# EAGLE design CarPC-CC-Rev3 (EAGLE 9.5.2)
Car-PC Command & Control sowie Power Distribution Board für PC, Access-Point

## Sheet 1 of 2
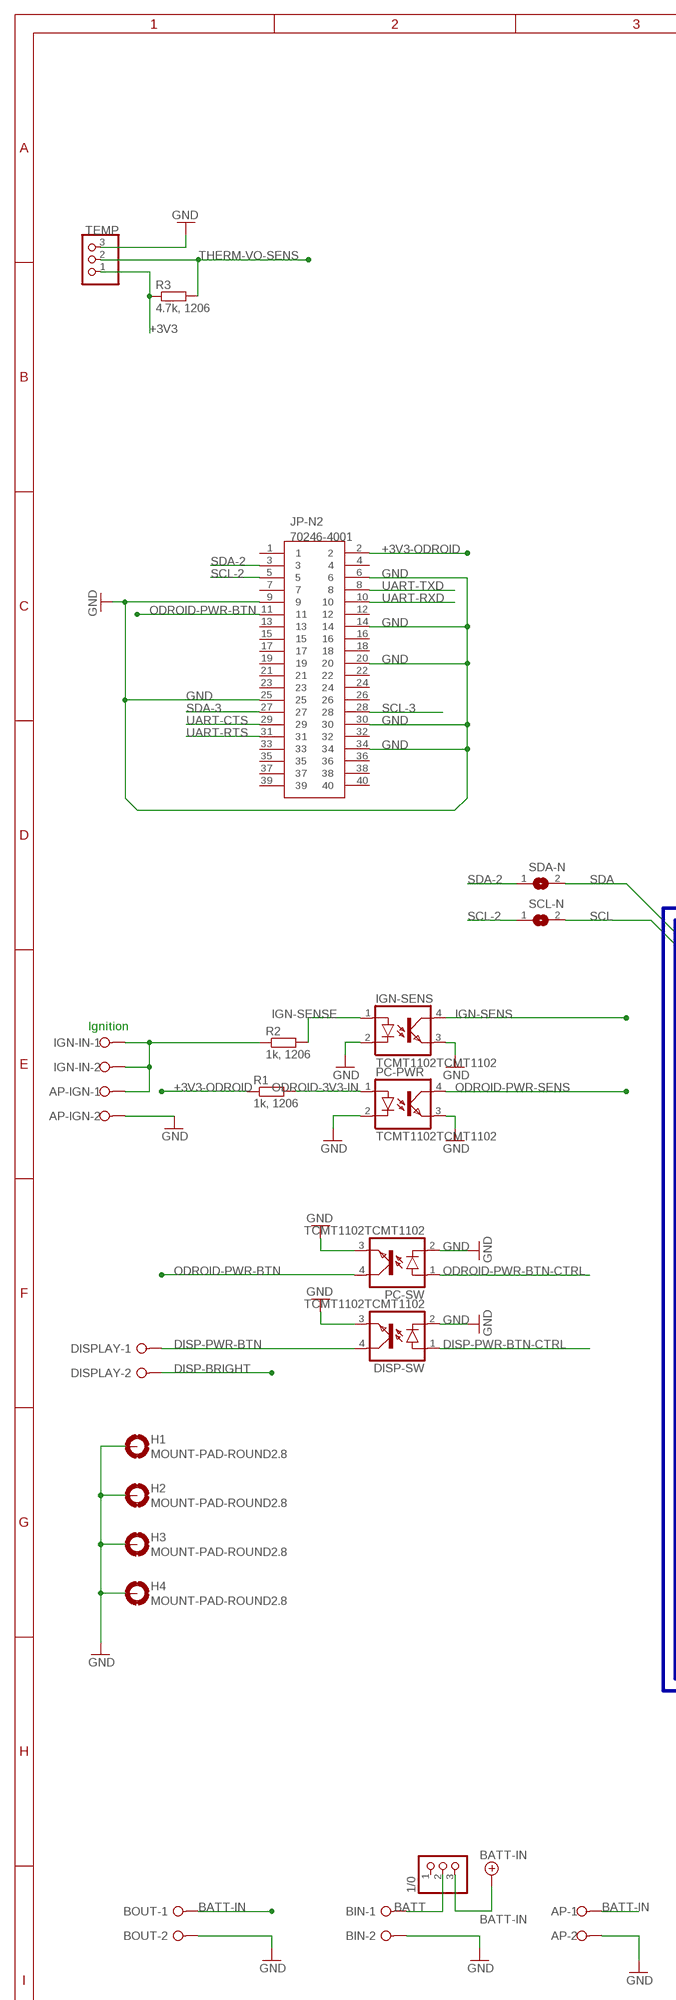
[diagram p0: schematic, sheet 1, part 1 of 2]
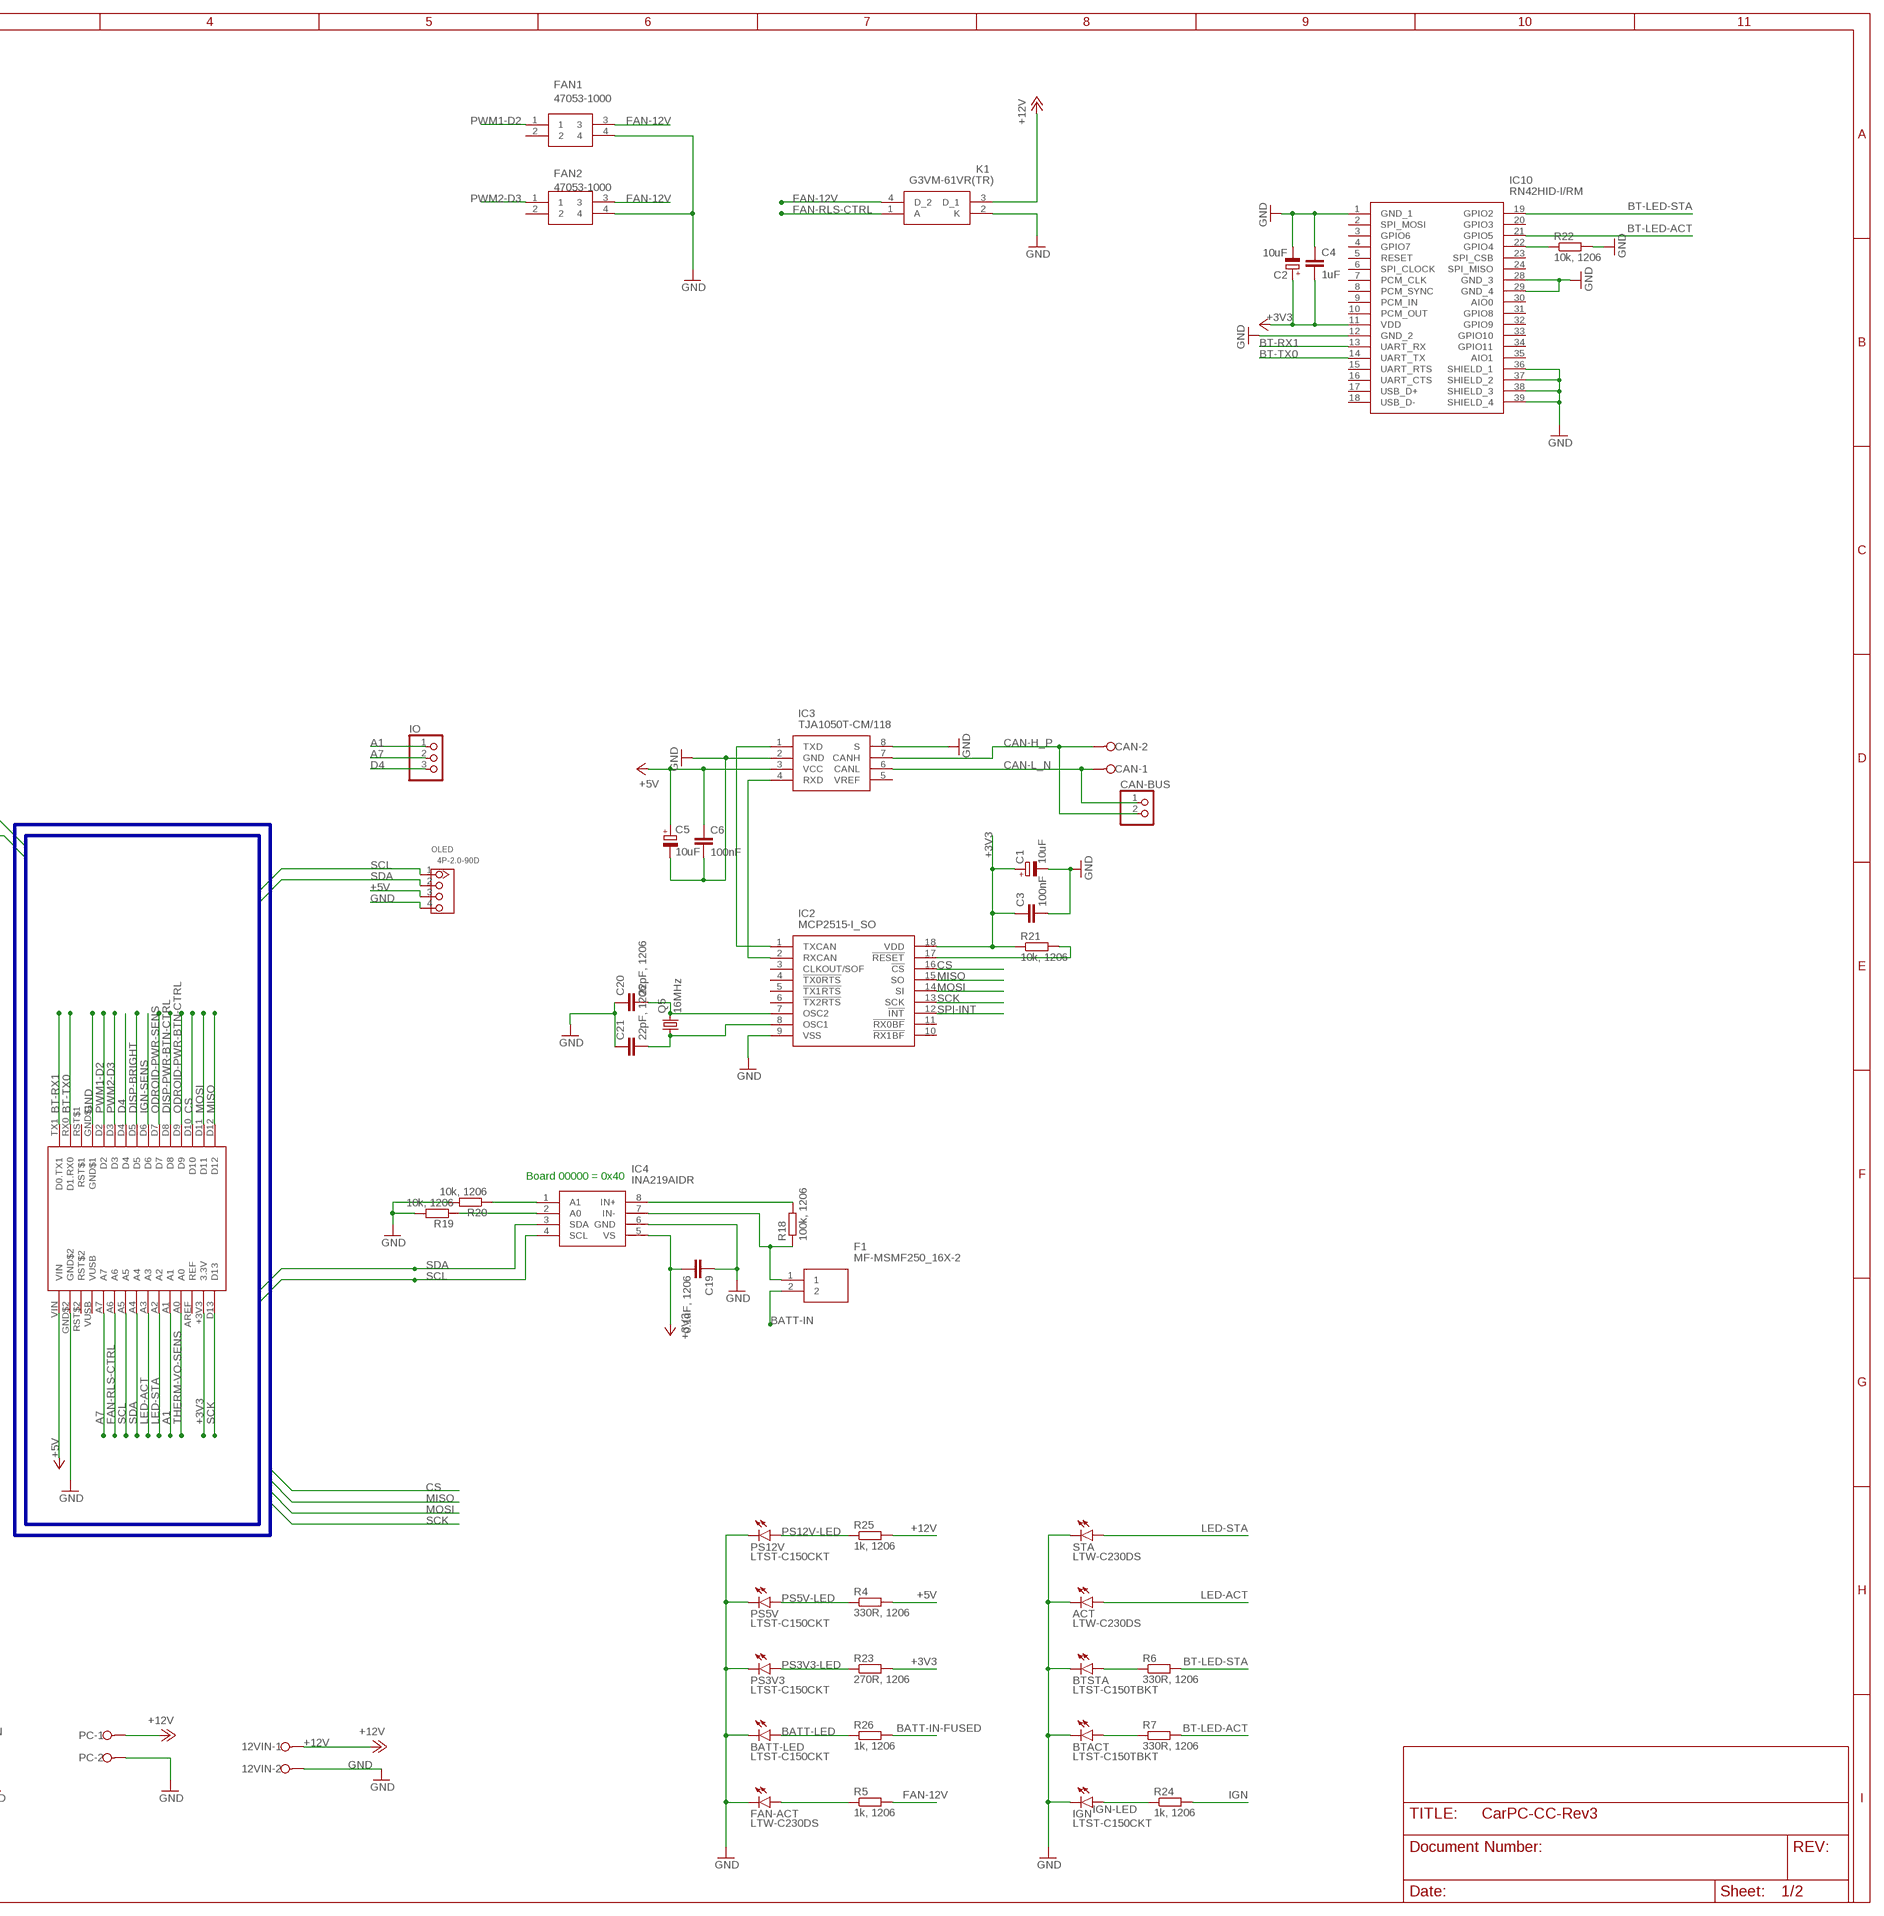
[diagram p1: schematic, sheet 1, part 2 of 2]

### Parts
1/0  PINHD-1X3  [1X03]
12VIN  W237-02P  [W237/132]
ACT  LTW-C230DS  LEDCHIPLED_1206  [CHIPLED_1206]
AP  W237-02P  [W237/132]
AP-IGN  W237-02P  [W237/132]
BATT-LED  LTST-C150CKT  LEDCHIPLED_1206  [CHIPLED_1206]
BIN  W237-02P  [W237/132]
BOUT  W237-02P  [W237/132]
BTACT  LTST-C150TBKT  LEDCHIPLED_1206  [CHIPLED_1206]
BTSTA  LTST-C150TBKT  LEDCHIPLED_1206  [CHIPLED_1206]
C1  10uF  CPOL-1206  [C1206]
C2  10uF  CPOL-1206  [C1206]
C3  100nF  C-EUC1206  [C1206]
C4  1uF  C-EUC1206  [C1206]
C5  10uF  CPOL-1206  [C1206]
C6  100nF  C-EUC1206  [C1206]
C19  0.1uF, 1206  C-EUC1206  [C1206]
C20  22pF, 1206  C-EUC1206  [C1206]
C21  22pF, 1206  C-EUC1206  [C1206]
CAN  W237-02P  [W237/132]
CAN-BUS  PINHD-1X2  [1X02]
DISP-SW  TCMT1102TCMT1102  [SOIC127P700X230-4N]
DISPLAY  W237-02P  [W237/132]
F1  MF-MSMF250_16X-2  [FUSC4632X160N]
FAN1  47053-1000  [47053-1000]
FAN2  47053-1000  [47053-1000]
FAN-ACT  LTW-C230DS  LEDCHIPLED_1206  [CHIPLED_1206]
H1  MOUNT-PAD-ROUND2.8  [2,8-PAD]
H2  MOUNT-PAD-ROUND2.8  [2,8-PAD]
H3  MOUNT-PAD-ROUND2.8  [2,8-PAD]
H4  MOUNT-PAD-ROUND2.8  [2,8-PAD]
IC2  MCP2515-I_SO  [SOIC127P1030X265-18N]
IC3  TJA1050T-CM/118  TJA1050T_CM,118  [SOIC127P600X175-8N]
IC4  INA219AIDR  [SOIC127P600X175-8N]
IC10  RN42HID-I/RM  RN42HID-I_RM  [RN42HIDIRM]
IGN  LTST-C150CKT  LEDCHIPLED_1206  [CHIPLED_1206]
IGN-IN  W237-02P  [W237/132]
IGN-SENS  TCMT1102TCMT1102  [SOIC127P700X230-4N]
IO  PINHD-1X3  [1X03]
JP-N2  70246-4001  [SHDR40W94P254_2X20_5842X889X92]
K1  G3VM-61VR(TR)  [G3VM61VRTR]
NANO_33_IOT  Arduino-Nano-33-IOT  ARDUINONANO33IOTARDUINONANO33IOT_SMD  [ARDNANO33IOT_SMD]
OLED  4P-2.0-90D  GROVE-CONNECTOR-DIP-90D(4P-2.0)  [HW4-2.0-90D]
PC  W237-02P  [W237/132]
PC-PWR  TCMT1102TCMT1102  [SOIC127P700X230-4N]
PC-SW  TCMT1102TCMT1102  [SOIC127P700X230-4N]
PS3V3  LTST-C150CKT  LEDCHIPLED_1206  [CHIPLED_1206]
PS5V  LTST-C150CKT  LEDCHIPLED_1206  [CHIPLED_1206]
PS12V  LTST-C150CKT  LEDCHIPLED_1206  [CHIPLED_1206]
Q5  16MHz  CRYSTALHC49S  [HC49-S]
R1  1k, 1206  R-EU_R1206  [R1206]
R2  1k, 1206  R-EU_R1206  [R1206]
R3  4.7k, 1206  R-EU_R1206  [R1206]
R4  330R, 1206  R-EU_R1206  [R1206]
R5  1k, 1206  R-EU_R1206  [R1206]
R6  330R, 1206  R-EU_R1206  [R1206]
R7  330R, 1206  R-EU_R1206  [R1206]
R18  100k, 1206  R-EU_R1206  [R1206]
R19  10k, 1206  R-EU_R1206  [R1206]
R20  10k, 1206  R-EU_R1206  [R1206]
R21  10k, 1206  R-EU_R1206  [R1206]
R22  10k, 1206  R-EU_R1206  [R1206]
R23  270R, 1206  R-EU_R1206  [R1206]
R24  1k, 1206  R-EU_R1206  [R1206]
R25  1k, 1206  R-EU_R1206  [R1206]
R26  1k, 1206  R-EU_R1206  [R1206]
SCL-N  SJ  [SJ]
SDA-N  SJ  [SJ]
STA  LTW-C230DS  LEDCHIPLED_1206  [CHIPLED_1206]
TEMP  PINHD-1X3/90  [1X03/90]

### Nets
+3V3 [3V3 Arduino]: C1.1(+) C2.1(+) C3.1 C4.2 C19.2 IC2.18(VDD) IC4.5(VS) IC10.11(VDD) NANO_33_IOT.+3V3(3.3V) R3.1 R21.1 R23.2 TEMP.1
+3V3-ODROID: JP-N2.2 R1.1
+5V [5v Regulated]: C5.1(+) C6.1 IC3.3(VCC) NANO_33_IOT.VIN OLED.3 R4.2 ; also sheet 2
+12V [12v Regulated]: 12VIN.1 K1.3(D_1) PC.1 R25.2 ; also sheet 2
A1: IO.1 NANO_33_IOT.A1
A7: IO.2 NANO_33_IOT.A7
BATT [11..14v Unfused]: 1/0.2 BIN.1
BATT-IN [11..14v Unfused]: 1/0.3 AP.1 BOUT.1 F1.2
BATT-IN-FUSED [11..14v Generator]: F1.1 IC4.7(IN-) R18.1 R26.2
BATT-LED: BATT-LED.A R26.1
BT-ACTIVATE [Chassis]: IC10.22(GPIO4) R22.1
BT-LED-ACT: IC10.21(GPIO5) R7.2
BT-LED-STA: IC10.19(GPIO2) R6.2
BT-RX1: IC10.13(UART_RX) NANO_33_IOT.TX1(D0.TX1)
BT-TX0: IC10.14(UART_TX) NANO_33_IOT.RX0(D1.RX0)
CAN-H_P [CAN]: CAN-BUS.2 CAN.2 IC3.7(CANH)
CAN-L_N [CAN]: CAN-BUS.1 CAN.1 IC3.6(CANL)
CS: IC2.16(!CS) NANO_33_IOT.D10
D4: IO.3 NANO_33_IOT.D4
DISP-BRIGHT [3V3 Arduino]: DISPLAY.2 NANO_33_IOT.D5
DISP-PWR-BTN: DISP-SW.4(COL) DISPLAY.1
DISP-PWR-BTN-CTRL [3V3 Arduino]: DISP-SW.1(A) NANO_33_IOT.D8
FAN-12V [12v Regulated]: FAN1.3 FAN2.3 K1.4(D_2) R5.2
FAN-RLS-CTRL [3V3 Arduino]: K1.1(A) NANO_33_IOT.A6
GND [Chassis]: 12VIN.2 ACT.C AP-IGN.2 AP.2 BATT-LED.C BIN.2 BOUT.2 BTACT.C BTSTA.C C1.2(-) C2.2(-) C3.2 C4.1 C5.2(-) C6.2 C19.1 C20.1 C21.1 DISP-SW.2(K) DISP-SW.3(EMI) FAN1.4 FAN2.4 FAN-ACT.C H1.B2,8(MOUNT) H2.B2,8(MOUNT) H3.B2,8(MOUNT) H4.B2,8(MOUNT) IC2.9(VSS) IC3.2(GND) IC3.8(S) IC4.6(GND) IC10.1(GND_1) IC10.12(GND_2) IC10.28(GND_3) IC10.29(GND_4) IC10.36(SHIELD_1) IC10.37(SHIELD_2) IC10.38(SHIELD_3) IC10.39(SHIELD_4) IGN-SENS.2(K) IGN-SENS.3(EMI) IGN.C JP-N2.6 JP-N2.9 JP-N2.14 JP-N2.20 JP-N2.25 JP-N2.30 JP-N2.34 K1.2(K) NANO_33_IOT.GND$1 NANO_33_IOT.GND$2 OLED.4 PC-PWR.2(K) PC-PWR.3(EMI) PC-SW.2(K) PC-SW.3(EMI) PC.2 PS3V3.C PS5V.C PS12V.C R19.2 R20.2 R22.2 STA.C TEMP.3 ; also sheet 2
IGN [11..14v Ignition]: AP-IGN.1 IGN-IN.1 IGN-IN.2 R2.1 R24.2
IGN-LED [12v Regulated]: IGN.A R24.1
IGN-SENS [3V3 Arduino]: IGN-SENS.4(COL) NANO_33_IOT.D6
IGN-SENSE: IGN-SENS.1(A) R2.2
INA-0X40-ADDR0: IC4.2(A0) R19.1
INA-0X40-ADDR1: IC4.1(A1) R20.1
LED-ACT: ACT.A NANO_33_IOT.A3
LED-STA: NANO_33_IOT.A2 STA.A
MCP-OSC1 [5V Signal]: C21.2 IC2.8(OSC1) Q5.1
MCP-OSC2 [5V Signal]: C20.2 IC2.7(OSC2) Q5.2
MCP-RESET: IC2.17(!RESET) R21.2
MCP-TJA-RX [5V Signal]: IC2.2(RXCAN) IC3.4(RXD)
MCP-TJA-TX [5V Signal]: IC2.1(TXCAN) IC3.1(TXD)
MISO: IC2.15(SO) NANO_33_IOT.D12
MOSI [3V3 Arduino]: IC2.14(SI) NANO_33_IOT.D11
N$2: FAN-ACT.A R5.1
N$3: BTSTA.A R6.1
N$4: BTACT.A R7.1
ODROID-3V3-IN: PC-PWR.1(A) R1.2
ODROID-PWR-BTN: JP-N2.11 PC-SW.4(COL)
ODROID-PWR-BTN-CTRL [3V3 Arduino]: NANO_33_IOT.D9 PC-SW.1(A)
ODROID-PWR-SENS [3V3 Arduino]: NANO_33_IOT.D7 PC-PWR.4(COL)
PS3V3-LED [3V3 Arduino]: PS3V3.A R23.1
PS5V-LED [5v Regulated]: PS5V.A R4.1
PS12V-LED: PS12V.A R25.1
PWM1-D2 [3V3 Signal]: FAN1.1 NANO_33_IOT.D2
PWM2-D3 [3V3 Signal]: FAN2.1 NANO_33_IOT.D3
SCK [3V3 Arduino]: IC2.13(SCK) NANO_33_IOT.D13
SCL [3V3 Signal]: IC4.4(SCL) NANO_33_IOT.A5 OLED.1 SCL-N.2
SCL-2: JP-N2.5 SCL-N.1
SCL-3: JP-N2.28
SDA [3V3 Signal]: IC4.3(SDA) NANO_33_IOT.A4 OLED.2 SDA-N.2
SDA-2: JP-N2.3 SDA-N.1
SDA-3: JP-N2.27
SHUNT+ [11..14v Generator]: IC4.8(IN+) R18.2
SPI-INT [5V Signal]: IC2.12(!INT)
THERM-VO-SENS [3V3 Arduino]: NANO_33_IOT.A0 R3.2 TEMP.2
UART-CTS: JP-N2.29
UART-RTS: JP-N2.31
UART-RXD: JP-N2.10
UART-TXD: JP-N2.8
Unconnected: 1/0.1 FAN1.2 FAN2.2 IC2.3(CLKOUT/SOF) IC2.4(!TX0RTS) IC2.5(!TX1RTS) IC2.6(!TX2RTS) IC2.10(!RX1BF) IC2.11(!RX0BF) IC3.5(VREF) IC10.2(SPI_MOSI) IC10.3(GPIO6) IC10.4(GPIO7) IC10.5(RESET) IC10.6(SPI_CLOCK) IC10.7(PCM_CLK) IC10.8(PCM_SYNC) IC10.9(PCM_IN) IC10.10(PCM_OUT) IC10.15(UART_RTS) IC10.16(UART_CTS) IC10.17(USB_D+) IC10.18(USB_D-) IC10.20(GPIO3) IC10.23(SPI_CSB) IC10.24(SPI_MISO) IC10.30(AIO0) IC10.31(GPIO8) IC10.32(GPIO9) IC10.33(GPIO10) IC10.34(GPIO11) IC10.35(AIO1) JP-N2.1 JP-N2.4 JP-N2.7 JP-N2.12 JP-N2.13 JP-N2.15 JP-N2.16 JP-N2.17 JP-N2.18 JP-N2.19 JP-N2.21 JP-N2.22 JP-N2.23 JP-N2.24 JP-N2.26 JP-N2.32 JP-N2.33 JP-N2.35 JP-N2.36 JP-N2.37 JP-N2.38 JP-N2.39 JP-N2.40 NANO_33_IOT.AREF(REF) NANO_33_IOT.RST$1 NANO_33_IOT.RST$2 NANO_33_IOT.VUSB

### Buses
I2C:SCL,SDA
SPI:CLK,CS,MISO,MOSI,SCK

### Notes on the sheet
- Ignition
- Board 00000 = 0x40

## Sheet 2 of 2: 12Vin, +3v3 and 5v out DC-DC Converters
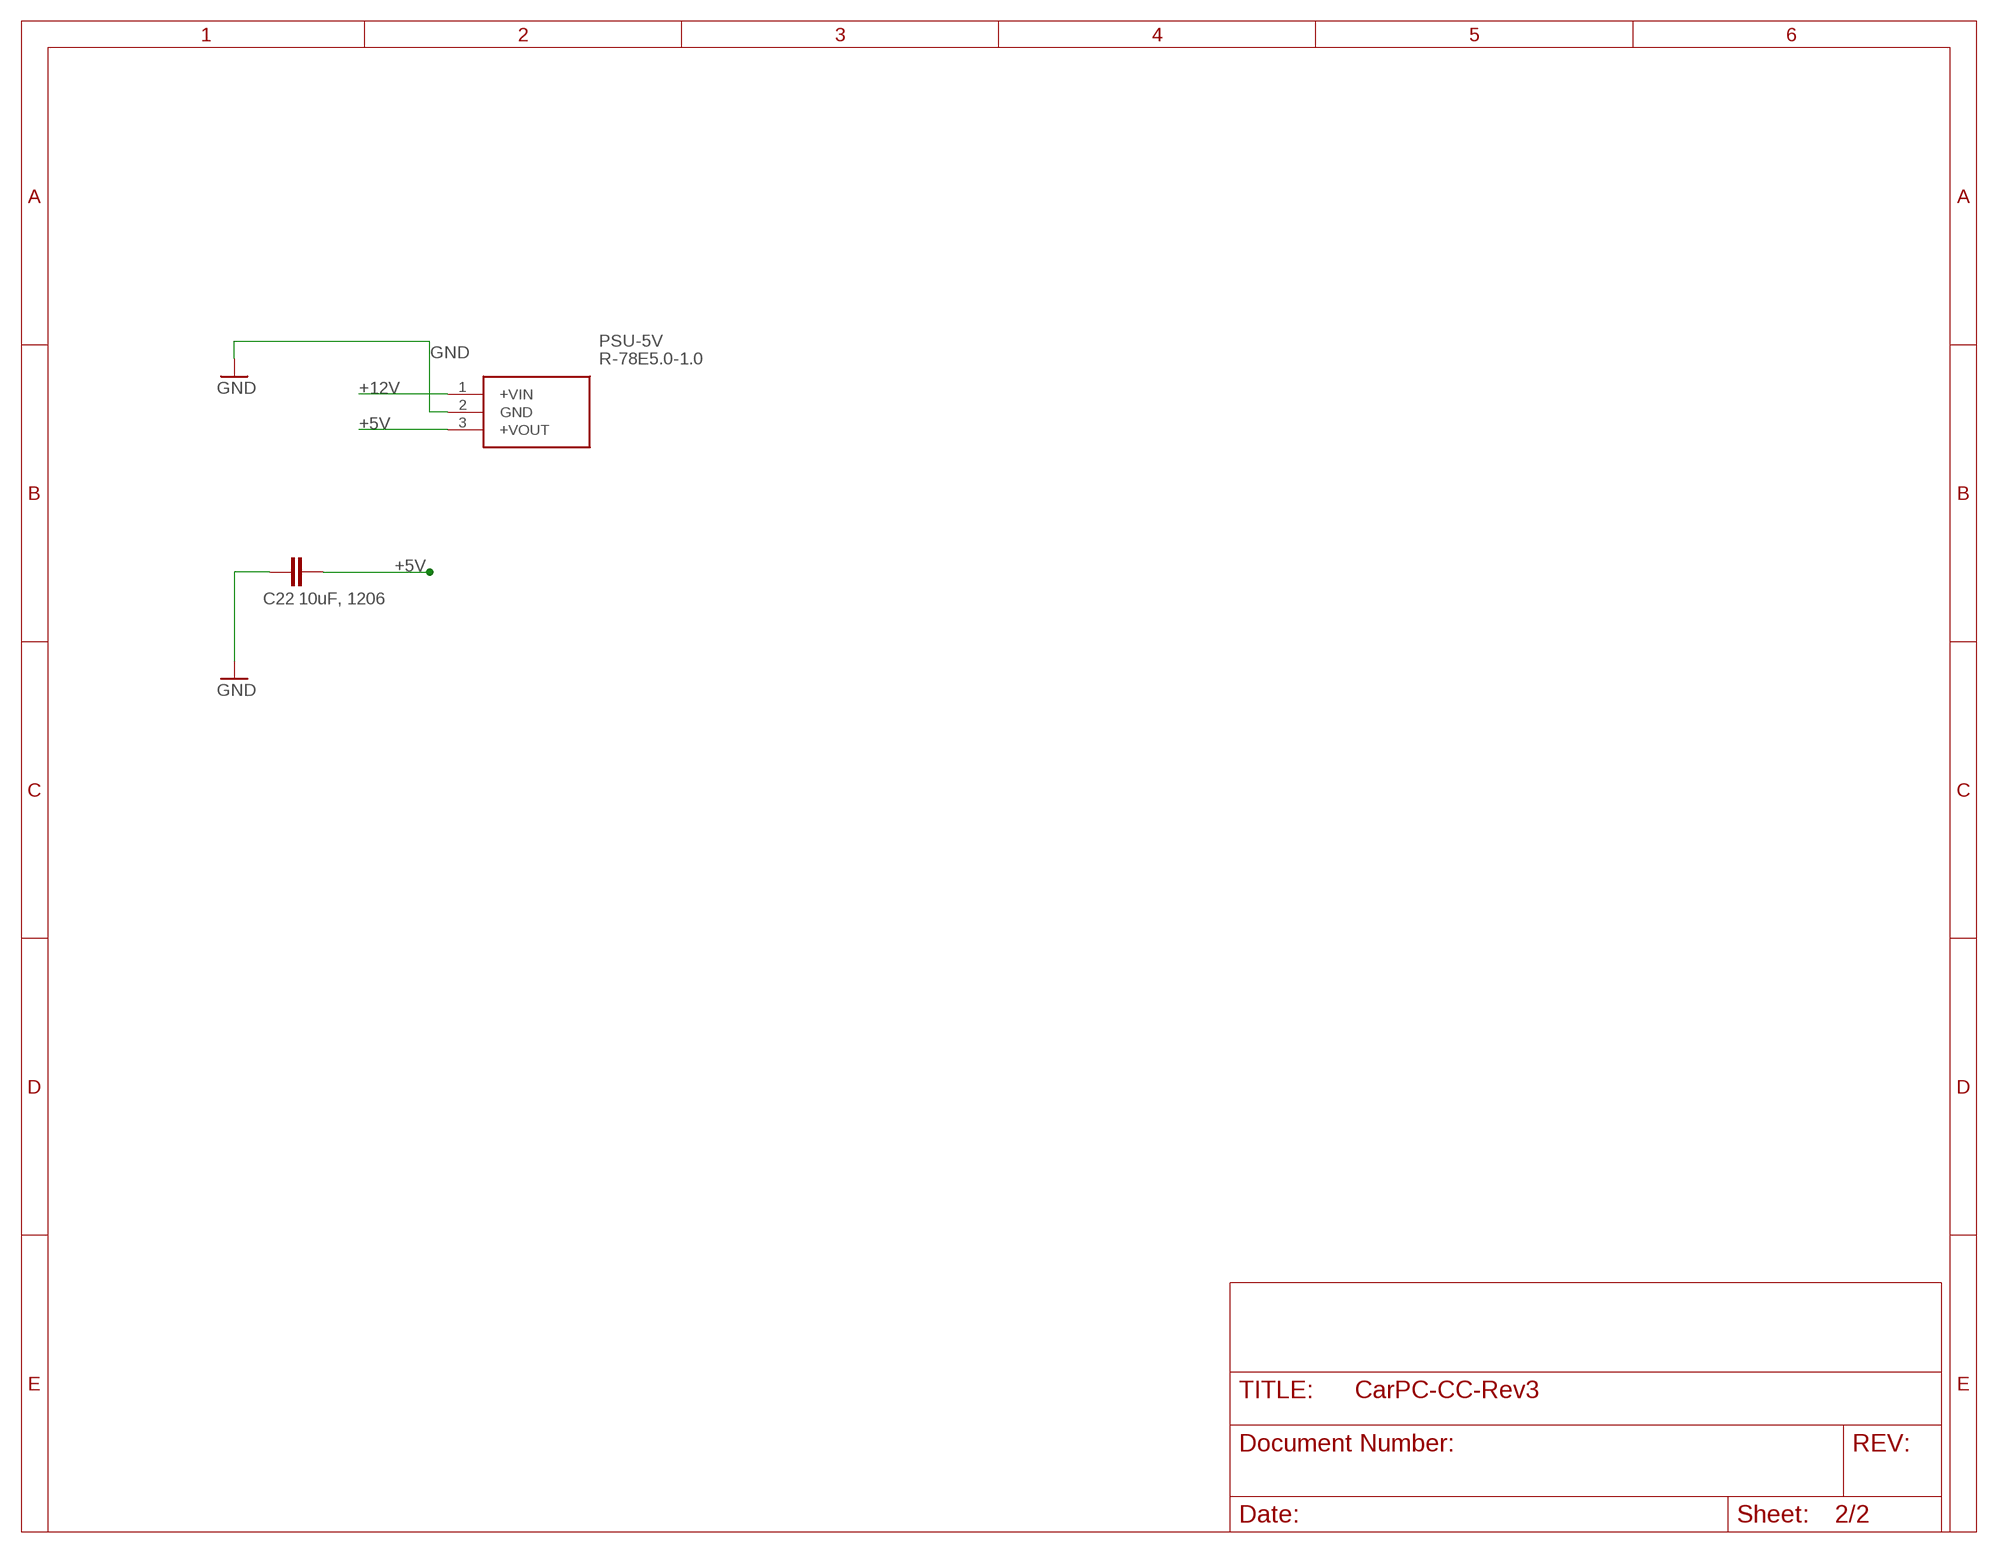
[diagram p2: schematic, sheet 2]

### Parts
C22  10uF, 1206  C-EUC1206  [C1206]
PSU-5V  R-78E5.0-1.0  [R-78E5.0-1.0]

### Nets
+5V [5v Regulated]: C22.2 PSU-5V.3(+VOUT) ; also sheet 1
+12V [12v Regulated]: PSU-5V.1(+VIN) ; also sheet 1
GND [Chassis]: C22.1 PSU-5V.2(GND) ; also sheet 1

## Library data of the parts
1/0 IO TEMP = pinhead:PINHD-1X3: PIN HEADER
12VIN AP AP-IGN BIN BOUT CAN DISPLAY IGN-IN PC = Custom:W237-02P: WAGO SREW CLAMP; OC_FARNELL: unknown; OC_NEWARK: unknown
ACT BATT-LED BTACT BTSTA FAN-ACT IGN PS3V3 PS5V PS12V STA = led:LED: LED OSRAM: - CHIPLED LG R971, LG N971, LY N971, LG Q971, LY Q971, LO R971, LY R971 LH N974, LH R974 LS Q976, LO Q976, LY Q976 LO Q996 - Hyper CHIPLED LW Q18S LB Q993, LB Q99A, LB R99A - SideLED LS A670, LO A670, LY A670, LG A670, LP A670 LB A673, LV A673, LT A673, LW A673 LH A674 LY A675 LS A676, LA A676, LO A676, LY A676, LW A676 LS A679, LY A679, LG A679 - Hyper Micro SIDELED® LS Y876, LA Y876, LO Y876, LY Y876 LT Y87S - SmartLED LW L88C, LW L88S LB L89C, LB L89S, LG L890 LS L89K, LO L89K, LY L89K LS L896, LA L896, LO L896, LY L896 - TOPLED LS T670, LO T670, LY T670, LG T670, LP T670 LSG T670, LSP T670, LSY T670, LOP T670, LYG T670 LG T671, LOG T671, LSG T671 LB T673, LV T673, LT T673, LW T673 LH T674 LS T676, LA T676, LO T676, LY T676, LB T676, LH T676, LSB T676, LW T676 LB T67C, LV T67C, LT T67C, LS T67K, LO T67K, LY T67K, LW E67C LS E67B, LA E67B, LO E67B, LY E67B, LB E67C, LV E67C, LT E67C LW T67C LS T679, LY T679, LG T679 LS T770, LO T770, LY T770, LG T770, LP T770 LB T773, LV T773, LT T773, LW T773 LH T774 LS E675, LA E675, LY E675, LS T675 LS T776, LA T776, LO T776, LY T776, LB T776 LHGB T686 LT T68C, LB T68C - Hyper Mini TOPLED® LB M676 - Mini TOPLED Santana® LG M470 LS M47K, LO M47K, LY M47K Source: http://www.osram.convergy.de LUXEON: - LUMILED® LXK2-PW12-R00, LXK2-PW12-S00, LXK2-PW14-U00, LXK2-PW14-V00 LXK2-PM12-R00, LXK2-PM12-S00, LXK2-PM14-U00 LXK2-PE12-Q00, LXK2-PE12-R00, LXK2-PE12-S00, LXK2-PE14-T00, LXK2-PE14-U00 LXK2-PB12-K00, LXK2-PB12-L00, LXK2-PB12-M00, LXK2-PB14-N00, LXK2-PB14-P00, LXK2-PB14-Q00 LXK2-PR12-L00, LXK2-PR12-M00, LXK2-PR14-Q00, LXK2-PR14-R00 LXK2-PD12-Q00, LXK2-PD12-R00, LXK2-PD12-S00 LXK2-PH12-R00, LXK2-PH12-S00 LXK2-PL12-P00, LXK2-PL12-Q00, LXK2-PL12-R00 Source: www.luxeon.com KINGBRIGHT: KA-3528ASYC Source: www.kingbright.com
C1 C2 C5 = Custom:CPOL-1206
C3 C4 C6 C19-C22 = rcl:C-EU: CAPACITOR, European symbol; SPICEPREFIX: C
CAN-BUS = pinhead:PINHD-1X2: PIN HEADER
DISP-SW IGN-SENS PC-PWR PC-SW = Custom:TCMT1102
F1 = Custom:MF-MSMF250_16X-2: PTC Resettable Fuse 2.5A(hold) 5A(trip) 16V 100A 1.2W 5s 0.015Ohm SMD Solder Pad 1812 T/R Automotive Source: Datasheet <https://www.arrow.com/en/products/mf-msmf25016x-2/bourns>; ALLIED_NUMBER: 70153471; ALLIED_PRICE-STOCK: https://www.alliedelec.com/bourns-mf-msmf250-16x-2/70153471/; DESCRIPTION: PTC Resettable Fuse 2.5A(hold) 5A(trip) 16V 100A 1.2W 5s 0.015Ohm SMD Solder Pad 1812 T/R Automotive; HEIGHT: 1.6mm; MANUFACTURER_NAME: Bourns; MANUFACTURER_PART_NUMBER: MF-MSMF250/16X-2; MOUSER_PART_NUMBER: 652-MF-MSMF250/16X-2; MOUSER_PRICE-STOCK: https://www.mouser.com/Search/Refine.aspx?Keyword=652-MF-MSMF250%2F16X-2; RS_PART_NUMBER: 8978967P; RS_PRICE-STOCK: http://uk.rs-online.com/web/p/products/8978967P
FAN1 FAN2 = Custom:47053-1000: MOLEX - 47053-1000 - HEADER, 4POS, 1ROW, 2.54MM Source: Datasheet <https://componentsearchengine.com/Datasheets/1/47053-1000.pdf>; DESCRIPTION: MOLEX - 47053-1000 - HEADER, 4POS, 1ROW, 2.54MM; HEIGHT: mm; MANUFACTURER_NAME: Molex; MANUFACTURER_PART_NUMBER: 47053-1000; MOUSER_PART_NUMBER: 538-47053-1000; MOUSER_PRICE-STOCK: https://www.mouser.com/Search/Refine.aspx?Keyword=538-47053-1000
H1-H4 = holes:MOUNT-PAD-ROUND: MOUNTING PAD, round
IC2 = Custom:MCP2515-I_SO: CAN Controller SPI data filtering SO18 Source: Datasheet <https://componentsearchengine.com/Datasheets/1/MCP2515-I_SO.pdf>; DESCRIPTION: CAN Controller SPI data filtering SO18; HEIGHT: 2.65mm; MANUFACTURER_NAME: Microchip; MANUFACTURER_PART_NUMBER: MCP2515-I/SO; MOUSER_PART_NUMBER: 579-MCP2515-I/SO; MOUSER_PRICE-STOCK: https://www.mouser.com/Search/Refine.aspx?Keyword=579-MCP2515-I%2FSO
IC3 = Custom:TJA1050T_CM,118: NXP - TJA1050T/CM,118 - CAN TRANSCEIVER, 1TX/RX, SOIC-8 Source: Datasheet <https://componentsearchengine.com/Datasheets/1/TJA1050T_CM,118.pdf>; DESCRIPTION: NXP - TJA1050T/CM,118 - CAN TRANSCEIVER, 1TX/RX, SOIC-8; HEIGHT: 1.75mm; MANUFACTURER_NAME: Nexperia; MANUFACTURER_PART_NUMBER: TJA1050T/CM,118; MOUSER_PART_NUMBER: 771-TJA1050T/CM118; MOUSER_PRICE-STOCK: https://www.mouser.com/Search/Refine.aspx?Keyword=771-TJA1050T%2FCM118
IC4 = Custom:INA219AIDR: 26-V, Bidirectional, Zero-Drift, High-Side, I2C Out Current/Power Monitor Source: Datasheet <http://www.ti.com/lit/gpn/ina219>; DESCRIPTION: 26-V, Bidirectional, Zero-Drift, High-Side, I2C Out Current/Power Monitor; HEIGHT: 1.75mm; MANUFACTURER_NAME: Texas Instruments; MANUFACTURER_PART_NUMBER: INA219AIDR; MOUSER_PART_NUMBER: 595-INA219AIDR; MOUSER_PRICE-STOCK: https://www.mouser.com/Search/Refine.aspx?Keyword=595-INA219AIDR
IC10 = Custom:RN42HID-I_RM: MICROCHIP - RN42HID-I/RM - BLUETOOTH MODULE, V2.1, 3MBPS Source: Datasheet <http://ww1.microchip.com/downloads/en/DeviceDoc/50002328A.pdf>; ALLIED_NUMBER: 70451526; ALLIED_PRICE-STOCK: https://www.alliedelec.com/microchip-technology-inc-rn42hid-i-rm/70451526/; DESCRIPTION: MICROCHIP - RN42HID-I/RM - BLUETOOTH MODULE, V2.1, 3MBPS; HEIGHT: 2mm; MANUFACTURER_NAME: Microchip; MANUFACTURER_PART_NUMBER: RN42HID-I/RM; MOUSER_PART_NUMBER: 765-RN42HID-I/RM; MOUSER_PRICE-STOCK: https://www.mouser.com/Search/Refine.aspx?Keyword=765-RN42HID-I%2FRM; RS_PART_NUMBER: 9123020; RS_PRICE-STOCK: http://uk.rs-online.com/web/p/products/9123020
JP-N2 = Custom:70246-4001: Header 2.54mm, dual row, vertical, 40w Molex C-GRID Series, Series Number 70246, 2.54mm Pitch 40 Way 2 Row Straight PCB Header, Solder Termination, 2.5A Source: Datasheet <http://uk.rs-online.com/web/p/products/6701825>; ALLIED_NUMBER: 70373451; ALLIED_PRICE-STOCK: https://www.alliedelec.com/molex-incorporated-70246-4001/70373451/; DESCRIPTION: Header 2.54mm, dual row, vertical, 40w Molex C-GRID Series, Series Number 70246, 2.54mm Pitch 40 Way 2 Row Straight PCB Header, Solder Termination, 2.5A; HEIGHT: 9.27mm; MANUFACTURER_NAME: Molex; MANUFACTURER_PART_NUMBER: 70246-4001; MOUSER_PART_NUMBER: 538-70246-4001; MOUSER_PRICE-STOCK: https://www.mouser.com/Search/Refine.aspx?Keyword=538-70246-4001; RS_PART_NUMBER: 6701825P; RS_PRICE-STOCK: http://uk.rs-online.com/web/p/products/6701825P
K1 = Custom:G3VM-61VR(TR): Solid State Relays - PCB Mount MOSFET Relay SOP4 60V 1400mA 1 Form A Source: Datasheet <https://www.arrow.com/en/products/g3vm-61vr-tr/omron>; ALLIED_NUMBER: 71240743; ALLIED_PRICE-STOCK: https://www.alliedelec.com/omronelectroniccomponents-g3vm-61vr-tr/71240743/; DESCRIPTION: Solid State Relays - PCB Mount MOSFET Relay SOP4 60V 1400mA 1 Form A; HEIGHT: 2.2mm; MANUFACTURER_NAME: Omron Electronics; MANUFACTURER_PART_NUMBER: G3VM-61VR(TR); MOUSER_PART_NUMBER: 653-G3VM-61VRTR; MOUSER_PRICE-STOCK: https://www.mouser.com/Search/Refine.aspx?Keyword=653-G3VM-61VRTR
NANO_33_IOT = Custom:ARDUINONANO33IOT
OLED = Custom:GROVE-CONNECTOR-DIP-90D(4P-2.0): 320110034
PSU-5V = Custom:R-78E5.0-1.0: Non-Isolated DC/DC Converters 8-28Vin 5V 1.0A THRU Source: Datasheet <http://www.recom-power.com/pdf/Innoline/R-78Exx-1.0.pdf>; DESCRIPTION: Non-Isolated DC/DC Converters 8-28Vin 5V 1.0A THRU; HEIGHT: mm; MANUFACTURER_NAME: RECOM Power; MANUFACTURER_PART_NUMBER: R-78E5.0-1.0; MOUSER_PART_NUMBER: 919-R-78E5.0-1.0; MOUSER_PRICE-STOCK: https://www.mouser.com/Search/Refine.aspx?Keyword=919-R-78E5.0-1.0; RS_PART_NUMBER: 1446290P; RS_PRICE-STOCK: http://uk.rs-online.com/web/p/products/1446290P
Q5 = Custom:CRYSTAL: CRYSTAL; OC_FARNELL: 1667008; OC_NEWARK: unknown
R1-R7 R18-R26 = rcl:R-EU_: RESISTOR, European symbol; SPICEPREFIX: R
SCL-N SDA-N = jumper:SJ: SMD solder JUMPER

## Net classes
0 default: width 0.254 mm
1 5v Regulated: width 0.762 mm
2 12v Regulated: width 1.27 mm
3 11..14v Ignition: width 1.27 mm
4 11..14v Generator: width 0.762 mm
5 Chassis: width 0.635 mm
6 0v Isolated: width 0.762 mm
7 3V3 Arduino: width 0.127 mm
8 5V Signal: width 0.127 mm
9 3V3 Signal: width 0.127 mm
10 11..14v Unfused: width 2.032 mm, clearance 0.762 mm

## Board
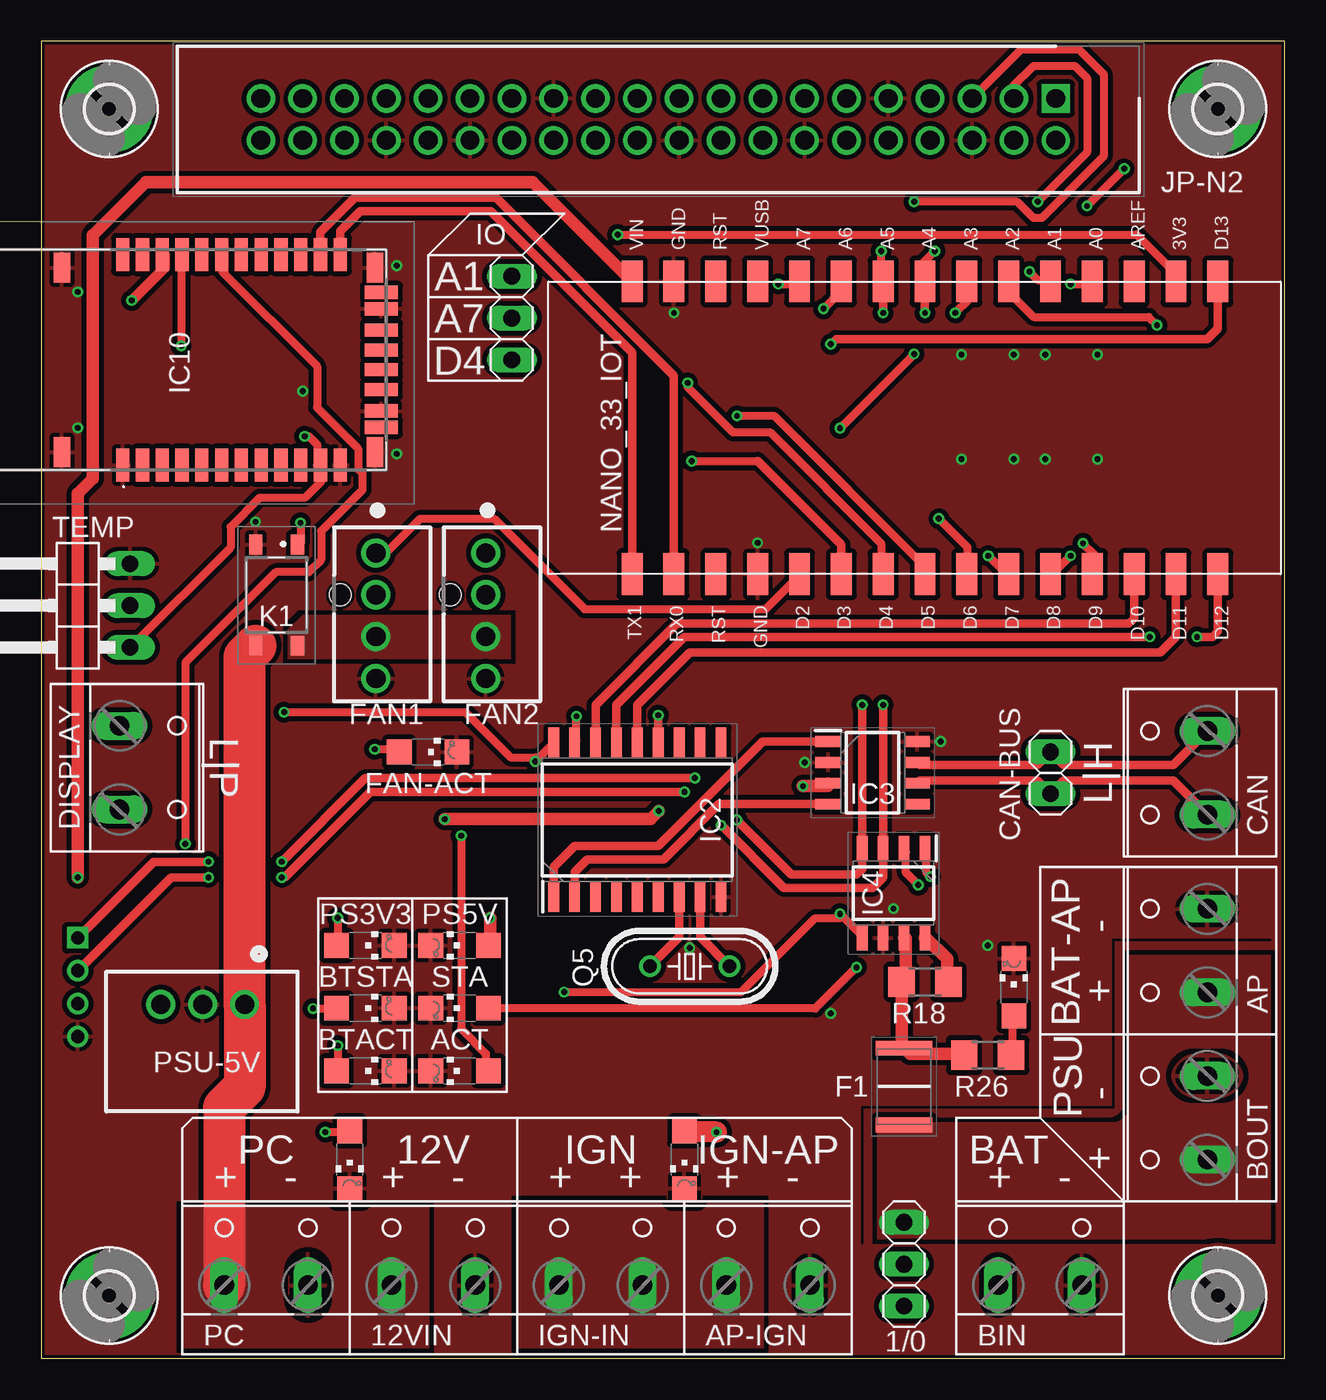
[diagram p3: board, top side]
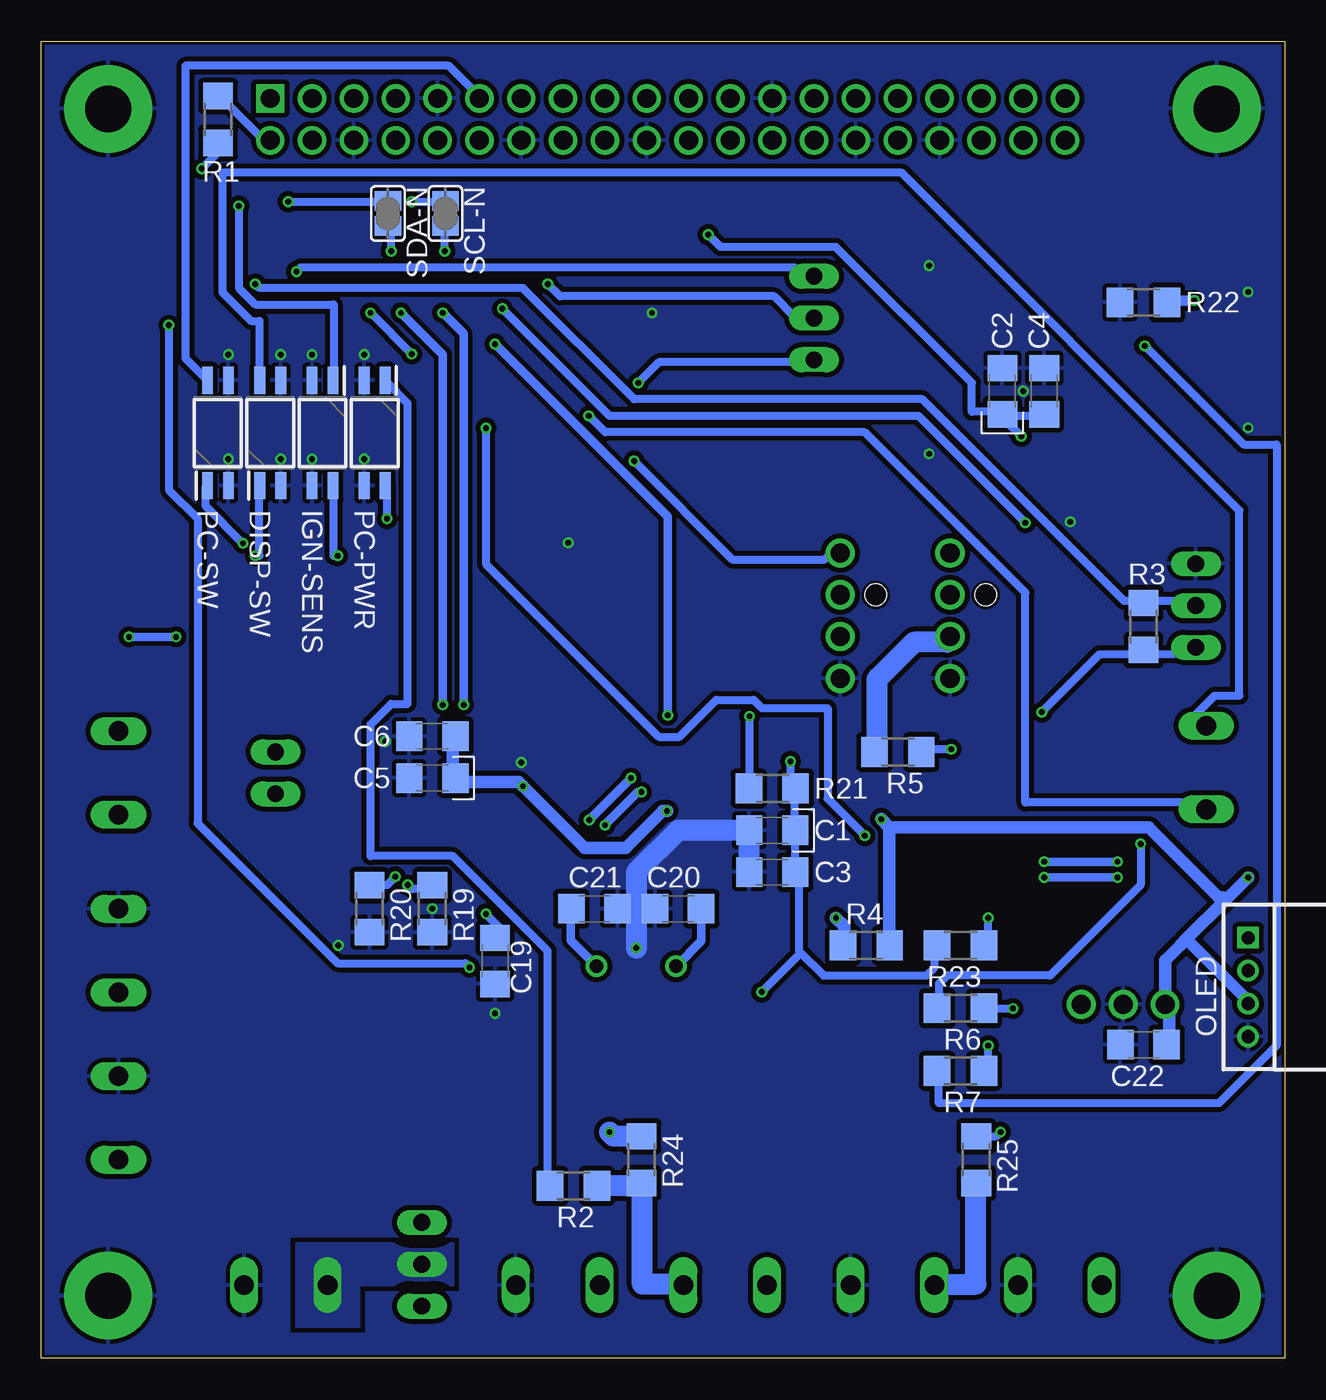
[diagram p4: board, bottom side, seen from below]

Size 75.5 x 80 mm. Coordinates in mm from the lower left corner, seen from the top.
Outline: 0,0 75.5,0 75.5,80 0,80 0,0
Copper layers (1*16): Top 0.035mm / dielectric 1.5mm / Bottom 0.035mm
Design rules "aisler_2_layer *": minimum track width 0.5mm, minimum drill 0.35mm, track to track 0.3mm, track to pad 0.2mm, pad to pad 0.2mm, via to via 0.2mm, smd to smd 0.2mm, copper to edge 0.2mm, drill to drill 0.21mm, minimum pad ring 0.25mm, minimum via ring 0.15mm, stop-mask expansion 0mil, vias tented up to drill 0.35mm, thermal gap 10mil
tRestrict: 9 lines

### Footprints (pad centres in the part's own frame; a part is rotated, then mirrored left to right if it is on the bottom)
1X03 = drill 1.016 long: 1 -2.54,0; 2 0,0; 3 2.54,0
W237/132 = drill 1.194 long: 1 -2.54,-0.635; 2 2.54,-0.635
CHIPLED_1206 = smd 1.5 x 1.5: A 0,-1.75; C 0,1.75
C1206 = smd 1.6 x 1.8: 1 -1.4,0; 2 1.4,0
1X02 = drill 1.016 long: 1 -1.27,0; 2 1.27,0
SOIC127P700X230-4N = smd 1.65 x 0.65: 1 -3.2,0.635; 2 -3.2,-0.635; 3 3.2,-0.635; 4 3.2,0.635
FUSC4632X160N = smd 0.89 x 3.43: 1 -2.325,0; 2 2.325,0
47053-1000 = drill 1.17 pad 1.77: 1 1.57,2.54; 2 4.11,2.54; 3 6.65,2.54; 4 9.19,2.54 | hole 1.3: 4.11,0.38
2,8-PAD = drill 2.8 pad 5.334: B2,8 0,0
SOIC127P1030X265-18N = smd 1.85 x 0.65: 1 -4.675,5.08; 2 -4.675,3.81; 3 -4.675,2.54; 4 -4.675,1.27; 5 -4.675,0; 6 -4.675,-1.27; 7 -4.675,-2.54; 8 -4.675,-3.81; 9 -4.675,-5.08; 10 4.675,-5.08; 11 4.675,-3.81; 12 4.675,-2.54; 13 4.675,-1.27; 14 4.675,0; 15 4.675,1.27; 16 4.675,2.54; 17 4.675,3.81; 18 4.675,5.08
SOIC127P600X175-8N = smd 1.528 x 0.65: 1 -2.711,1.905; 2 -2.711,0.635; 3 -2.711,-0.635; 4 -2.711,-1.905; 5 2.711,-1.905; 6 2.711,-0.635; 7 2.711,0.635; 8 2.711,1.905
RN42HIDIRM = smd 2 x 0.8: 1 -6.4,16; 2 -6.4,14.8; 3 -6.4,13.6; 4 -6.4,12.4; 5 -6.4,11.2; 6 -6.4,10; 7 -6.4,8.8; 8 -6.4,7.6; 9 -6.4,6.4; 10 -6.4,5.2; 11 -6.4,4; 12 -6.4,2.8; 13 6.4,2.8; 14 6.4,4; 15 6.4,5.2; 16 6.4,6.4; 17 6.4,7.6; 18 6.4,8.8; 19 6.4,10; 20 6.4,11.2; 21 6.4,12.4; 22 6.4,13.6; 23 6.4,14.8; 24 6.4,16 | smd 0.8 x 2: 28 3.1,0.3; 29 -3.1,0.3; 30 4.1,0.3; 31 1.8,0.3; 32 0.6,0.3; 33 -0.6,0.3; 34 -1.8,0.3; 35 -4.1,0.3 | smd 1.8 x 1: 36 -5.6,0.7; 37 -5.6,19.7; 38 5.6,0.7; 39 5.6,19.7
SHDR40W94P254_2X20_5842X889X92 = drill 1.15 pad 1.725 square: 1 0,0 | drill 1.15 pad 1.725: 2 0,2.54; 3 2.54,0; 4 2.54,2.54; 5 5.08,0; 6 5.08,2.54; 7 7.62,0; 8 7.62,2.54; 9 10.16,0; 10 10.16,2.54; 11 12.7,0; 12 12.7,2.54; 13 15.24,0; 14 15.24,2.54; 15 17.78,0; 16 17.78,2.54; 17 20.32,0; 18 20.32,2.54; 19 22.86,0; 20 22.86,2.54; 21 25.4,0; 22 25.4,2.54; 23 27.94,0; 24 27.94,2.54; 25 30.48,0; 26 30.48,2.54; 27 33.02,0; 28 33.02,2.54; 29 35.56,0; 30 35.56,2.54; 31 38.1,0; 32 38.1,2.54; 33 40.64,0; 34 40.64,2.54; 35 43.18,0; 36 43.18,2.54; 37 45.72,0; 38 45.72,2.54; 39 48.26,0; 40 48.26,2.54
G3VM61VRTR = smd 0.8 x 1.2: 1 -1.27,-3.075; 2 1.27,-3.075; 3 1.27,3.075; 4 -1.27,3.075
ARDNANO33IOT_SMD = smd 1.27 x 2.54: +3V3 33.02,16.51; A0 27.94,16.51; A1 25.4,16.51; A2 22.86,16.51; A3 20.32,16.51; A4 17.78,16.51; A5 15.24,16.51; A6 12.7,16.51; A7 10.16,16.51; AREF 30.48,16.51; D2 10.16,-1.27; D3 12.7,-1.27; D4 15.24,-1.27; D5 17.78,-1.27; D6 20.32,-1.27; D7 22.86,-1.27; D8 25.4,-1.27; D9 27.94,-1.27; D10 30.48,-1.27; D11 33.02,-1.27; D12 35.56,-1.27; D13 35.56,16.51; GND$1 7.62,-1.27; GND$2 2.54,16.51; RST$1 5.08,-1.27; RST$2 5.08,16.51; RX0 2.54,-1.27; TX1 0,-1.27; VIN 0,16.51; VUSB 7.62,16.51
HW4-2.0-90D = drill 0.8 pad 1.27 square: 1 -3,0 | drill 0.8 pad 1.27: 2 -1,0; 3 1,0; 4 3,0
R-78E5.0-1.0 = drill 1.15 pad 1.75: 1 3.21,2; 2 5.75,2; 3 8.29,2
HC49-S = drill 0.813: 1 -2.413,0; 2 2.413,0
R1206 = smd 1.6 x 1.803: 1 -1.422,0; 2 1.422,0
SJ = smd 1.168 x 1.6: 1 -0.762,0; 2 0.762,0
1X03/90 = drill 1.016 long: 1 -2.54,-3.81; 2 0,-3.81; 3 2.54,-3.81

### Placement (x,y rotation side)
1/0  52.39,5.71 90 top
12VIN  23.81,5.08 0 top
ACT  25.4,17.46 90 top
AP  70.17,24.76 90 top
AP-IGN  44.13,5.08 0 top
BATT-LED  59.05,22.54 0 top
BIN  60.64,5.08 0 top
BOUT  70.17,14.61 90 top
BTACT  19.68,17.46 270 top
BTSTA  19.68,21.27 270 top
C1  31.11,32.07 180 bottom
C2  17.14,58.74 90 bottom
C3  31.11,29.53 180 bottom
C4  14.61,58.74 270 bottom
C5  51.75,35.24 180 bottom
C6  51.75,37.78 180 bottom
C19  47.94,24.13 90 bottom
C20  36.83,27.3 0 bottom
C21  41.91,27.3 180 bottom
C22  8.57,19.05 0 bottom
CAN  70.17,35.56 90 top
CAN-BUS  61.28,35.56 90 top
DISP-SW  61.59,56.2 90 bottom
DISPLAY  5.4,35.88 270 top
F1  52.39,16.51 270 top
FAN1  17.78,50.48 270 top
FAN2  24.45,50.48 270 top
FAN-ACT  23.5,36.83 270 top
H1  4.13,3.81 0 top
H2  4.13,75.88 0 top
H3  71.44,3.81 0 top
H4  71.44,75.88 0 top
IC2  36.2,32.7 90 top
IC3  50.48,35.56 0 top
IC4  51.75,28.26 270 top
IC10  20.95,60.64 90 top
IGN  39.05,12.07 180 top
IGN-IN  33.97,5.08 0 top
IGN-SENS  55.24,56.2 270 bottom
IO  28.57,63.18 270 top
JP-N2  61.59,76.52 180 top
K1  14.29,46.36 180 top
NANO_33_IOT  35.88,48.89 0 top
OLED  2.22,22.54 270 bottom
PC  13.65,5.08 0 top
PC-PWR  58.42,56.2 270 bottom
PC-SW  64.77,56.2 90 bottom
PS3V3  19.68,25.08 270 top
PS5V  25.4,25.08 90 top
PS12V  18.73,12.07 180 top
PSU-5V  15.56,23.5 180 top
Q5  39.37,23.81 180 top
R1  64.77,75.25 270 bottom
R2  43.18,10.48 180 bottom
R3  8.57,44.45 90 bottom
R4  25.4,25.08 0 bottom
R5  23.5,36.83 180 bottom
R6  19.68,21.27 180 bottom
R7  19.68,17.46 180 bottom
R18  53.66,22.86 0 top
R19  51.75,27.3 270 bottom
R20  55.56,27.3 270 bottom
R21  31.11,34.61 180 bottom
R22  8.57,64.14 180 bottom
R23  19.68,25.08 180 bottom
R24  39.05,12.07 270 bottom
R25  18.73,12.07 270 bottom
R26  57.47,18.41 180 top
SCL-N  50.96,69.53 270 bottom
SDA-N  54.45,69.53 270 bottom
STA  25.4,21.27 90 top
TEMP  1.59,45.72 90 top

### Tracks (layer width: path | path; a pad name or v marks a point on that pad's centre or on a via)
+3V3  (via drill 0.35)
  Top 0.5: IC4.5 49.75,25.75 v48.5,27 48.5,26.75 47,26.75 42.5,22.25 v31.75,22.25 | IC2.18 31,37.25 v30,36.25 30,36.5 28.5,36.5 25.75,39.25 v14.75,39.25 | v16,56 16.25,56 16.75,55.5 16.75,54.25 IC10.11 17,54 17,53.25 16,52.25 13.25,52.25 11.5,50.5 11.5,49.25 5.5,43.25 TEMP.1 | v35,68.25 66.5,68.25 68.75,66 68.75,65.5 NANO_33_IOT.+3V3
  Bottom 0.5: v48.5,27 47.5,26 47.5,25.75 47.75,25.75 C19.2 | 29.38,24.62 29.5,24.75 29.5,29.5 C3.1 29.75,29.75 29.75,32 C1.1 29.75,32.25 29.75,34.5 R21.1 29.75,34.75 30,34.75 v30,36.25 | 29.38,24.62 28,23.25 21.75,23.25 21.25,23.75 21.25,25 R23.2 | 29.38,24.62 v31.75,22.25 | TEMP.1 5.5,43 6.5,43 6.75,42.75 8.25,42.75 8.5,43 R3.1 8.5,42.75 11.25,42.75 v14.75,39.25 | C4.2 14.75,57.25 17,57.25 C2.1 | v16,56 17,57 C2.1 | v35,68.25 34.25,67.5 27.25,67.5 19,59.25 19,57.5 17.25,57.5 C2.1
+3V3-ODROID
  Bottom 0.5: 64.75,76.75 R1.1 64.5,76.5 62,74 JP-N2.2
+5V  (via drill 0.35)
  Top 0.762: NANO_33_IOT.VIN 29.84,71.44 6.35,71.44 3.13,68.22 3.13,53.42 2.22,52.52 v2.22,29.21 | v46.25,34.75 47.75,34.75 IC3.3 | v37.5,33.25 37,32.75 v24.5,32.75
  Bottom 0.762: v2.22,29.21 3.59,27.84 | 3.59,27.84 5.97,25.47 | 5.97,25.47 6.32,25.11 7.27,24.16 7.27,23.4 PSU-5V.3 7,21.25 7,19.25 C22.2 | C6.1 50.5,37.75 50.5,35.5 C5.1 50.25,35 46.5,35 v46.25,34.75 42.5,31 40,31 37.75,33.25 v37.5,33.25 | 24,32.25 24,25.25 R4.2 | 24,32.25 8.25,32.25 4,28 3.75,28 3.59,27.84 | 5.97,25.47 2.25,21.75 OLED.3 | v24.5,32.75 24,32.25
+12V
  Top 2.54: PC.1 11.11,15.24 12.35,16.47 PSU-5V.1 12.35,42.61 K1.3
  Bottom 1.27: R25.2 18.75,10.5 18.75,4.5 21.25,4.5 12VIN.1
  pour Top (isolate 0.61, no thermals): 8.57,0.32 8.57,9.21 23.5,9.21 23.5,0.32
A1  (via drill 0.35)
  Top 0.5: v60,66 60.5,65.5 61.25,65.5 NANO_33_IOT.A1
  Bottom 0.5: v60,66 59.75,66.25 29.75,66.25 29.25,65.75 28.75,65.75 IO.1
A7  (via drill 0.35)
  Top 0.5: v44.75,65.25 46,65.25 NANO_33_IOT.A7
  Bottom 0.5: v44.75,65.25 44,64.5 31,64.5 29.75,63.25 28.75,63.25 IO.2
BATT
  pour Bottom (no thermals): 50.48,6.98 60.01,6.98 60.01,1.9 56.2,1.9 56.2,4.45 50.48,4.45
BATT-IN
  pour Top (isolate 0.813, no thermals): 50.16,7.3 74.93,7.3 74.93,25.08 65.41,25.08 65.41,14.61 50.16,14.61
BATT-IN-FUSED
  Top 0.762: IC4.7 52.5,25.5 52.5,23.25 52.25,23 R18.1 52.25,22.5 52.25,19 F1.1 52.5,18.75 52.75,18.5 56,18.5 R26.2
BATT-LED
  Top 0.5: BATT-LED.A 59,20.75 59,18.5 R26.1
BT-ACTIVATE  (via drill 0.35)
  Top 0.635: v5.5,64.25 7.5,66.25 7.5,67 IC10.22
  Bottom 0.635: v5.5,64.25 7,64.25 R22.1
BT-LED-ACT  (via drill 0.35)
  Top 0.5: v8.5,61.5 8.5,67 IC10.21
  Bottom 0.5: v8.5,61.5 2.5,55.5 0.5,55.5 0.5,19 4,15.5 21,15.5 21,17.25 R7.2
BT-LED-STA  (via drill 0.35)
  Top 0.5: v8.75,31.25 8.75,42.25 14.25,47.75 16.25,47.75 17,48.5 17,50.25 19.5,52.75 19.5,53.75 19.25,54 19.25,55.25 16.75,57.75 16.75,60.25 11,66 11,67 IC10.19
  Bottom 0.5: v8.75,31.25 8.75,28.75 14.25,23.25 20.5,23.25 21,22.75 21,21.5 R6.2
BT-RX1
  Top 0.508: IC10.13 18.16,68.45 19.39,69.68 27.29,69.68 35.88,61.09 NANO_33_IOT.TX1
BT-TX0
  Top 0.508: IC10.14 16.95,68.39 19.05,70.48 27.62,70.48 38.42,59.69 NANO_33_IOT.RX0
CAN-H_P
  Top 0.508: CAN.2 68.74,36.04 62.07,36.04 CAN-BUS.2 60.48,36.04 53.35,36.04 IC3.7
CAN-L_N
  Top 0.508: CAN.1 68.74,35.08 62.07,35.08 CAN-BUS.1 60.48,35.08 53.35,35.08 IC3.6
CS
  Top 0.508: IC2.16 33.66,39.69 38.59,44.62 66.04,44.62 66.36,44.94 NANO_33_IOT.D10
D4  (via drill 0.35)
  Top 0.5: v39.25,59.25 39.25,59 42,56.25 44.25,56.25 51,49.5 51,47.75 NANO_33_IOT.D4
  Bottom 0.5: v39.25,59.25 38,60.5 28.75,60.5 IO.3
DISP-BRIGHT  (via drill 0.35)
  Top 0.5: v42.25,57.25 44.5,57.25 53.5,48.25 53.5,47.75 NANO_33_IOT.D5
  Bottom 0.5: v42.25,57.25 41.25,56.25 25.5,56.25 15.75,46.5 15.75,33.75 6.25,33.75 6,33.5 5,33.5 DISPLAY.2
DISP-PWR-BTN
  Bottom 0.5: DISP-SW.4 62.25,59.5 62.25,63 62.75,63 64.5,64.75 64.5,72 23.25,72 2.75,51.5 2.75,40.25 4.25,40.25 5.5,39 5.5,38.5 5,38.5 DISPLAY.1
DISP-PWR-BTN-CTRL  (via drill 0.35)
  Top 0.5: v62.5,48.75 61.5,47.75 NANO_33_IOT.D8
  Bottom 0.5: v62.5,48.75 62.25,48.75 62.25,53 DISP-SW.1
FAN-12V
  Bottom 1.27: R5.2 24.77,36.98 24.77,41.26 24.5,41.5 22.5,43.5 20.5,43.5 FAN1.3
  pour Top (no thermals): 14.92,44.13 15.88,45.09 28.57,45.09 28.57,42.55 14.92,42.55
FAN-RLS-CTRL  (via drill 0.35)
  Top 0.5: v15.75,50.75 15.75,49.5 K1.1 | v47.5,63.75 48.5,64.75 48.5,65.25 NANO_33_IOT.A6
  Bottom 0.5: v15.75,50.75 22.25,57.25 41,57.25 v47.5,63.75
GND  (via drill 0.35)
  Bottom 1.27: v39.37,24.92 39.37,29.53 36.83,32.07 34.29,32.07 C1.2 C3.2
  other vias: 2.22,64.77 2.22,56.52 21.59,66.36 21.59,54.93 38.42,63.5 43.5,49.53 47.94,20.96 57.47,25.08 54.61,37.47 55.88,54.61 59.05,54.61 60.96,54.61 64.14,54.61 60.96,60.96 64.14,60.96 51.75,27.3 15.88,58.74 13.02,50.8 46.35,36.19 55.88,60.96 59.05,60.96
  pour Top (rank 6): -2.86,82.23 78.11,82.23 78.11,-1.91 -2.86,-1.91
  pour Bottom (rank 6): -5.08,84.45 80.33,84.45 80.33,-3.49 -5.08,-3.49
IGN
  Bottom 1.27: R2.1 41.75,10.5 39.25,10.5 R24.2 39,10 39,4.5 36.75,4.5 IGN-IN.2
  pour Top (isolate 0.61, no thermals): 28.89,0.32 28.89,9.52 43.81,9.52 43.81,0.32
IGN-LED  (via drill 0.35)
  Top 1.27: v41,13.75 39.25,13.75 IGN.A
  Bottom 1.27: v41,13.75 40.75,13.5 39.25,13.5 R24.1
IGN-SENS  (via drill 0.35)
  Top 0.5: v54.5,51 56.25,49.25 56.25,47.75 NANO_33_IOT.D6
  Bottom 0.5: v54.5,51 54.5,53 IGN-SENS.4
IGN-SENSE
  Bottom 0.5: IGN-SENS.1 54.5,59.25 53.25,58 53.25,39.75 54.25,39.75 55.5,38.5 55.5,30.5 50.5,30.5 44.75,24.75 44.75,10.5 R2.2
INA-0X40-ADDR0  (via drill 0.35)
  Top 0.5: v53.25,28.75 52.5,29.5 52.5,30.75 IC4.2
  Bottom 0.5: v53.25,28.75 53,28.5 52,28.5 R19.1
INA-0X40-ADDR1  (via drill 0.35)
  Top 0.5: v54,29.25 53.75,29.5 53.75,30.75 IC4.1
  Bottom 0.5: v54,29.25 54.5,28.75 55.5,28.75 R20.1
LED-ACT  (via drill 0.35)
  Top 0.5: v25.5,31.75 25.5,20 27,18.5 27,17.5 ACT.A | v53,61 v48.5,56.5 | v55.5,63.5 56.25,64.25 56.25,65.25 NANO_33_IOT.A3
  Bottom 0.5: v25.5,31.75 27.75,34 27.75,39.5 31.75,39.5 32.25,40 34.5,40 36.75,37.75 38,37.75 48.5,48.25 v48.5,56.5 | v55.5,63.5 v53,61
LED-STA  (via drill 0.35)
  Top 0.5: v49.5,23.75 47,21.25 27.25,21.25 STA.A | v67.75,62.75 67.25,63.25 60.25,63.25 58.75,64.75 58.75,65.25 NANO_33_IOT.A2
  Bottom 0.5: v49.5,23.75 49.75,24 57.5,24 66,32.5 66,51 67.75,52.75 v67.75,62.75
MCP-OSC1
  Top 0.508: IC2.8 40.01,25.59 Q5.1
  Bottom 0.5: C21.2 43.25,27.5 43.34,27.28
  Bottom 0.508: Q5.1 43.34,25.37 43.34,27.28
MCP-OSC2
  Top 0.508: IC2.7 38.73,25.59 Q5.2
  Bottom 0.508: Q5.2 35.43,25.34 C20.2
MCP-RESET  (via drill 0.35)
  Top 0.5: v32.5,39 32.5,37.5 IC2.17
  Bottom 0.5: v32.5,39 32.5,34.75 R21.2
MCP-TJA-RX
  Top 0.508: IC3.4 41.15,33.65 37.8,30.31 33.16,30.31 32.38,29.53 IC2.2
MCP-TJA-TX
  Top 0.508: IC3.1 43.81,37.47 37.47,31.11 32.38,31.11 31.11,29.84 IC2.1
MISO  (via drill 0.35)
  Top 0.508: IC2.15 34.92,39.69 39.05,43.82 v67.31,43.82 | v70.17,43.82 71.12,43.82 71.44,44.13 NANO_33_IOT.D12
  Bottom 0.508: v67.31,43.82 v70.17,43.82
MOSI
  Top 0.508: IC2.14 36.2,39.69 39.37,42.86 67.94,42.86 68.9,43.82 NANO_33_IOT.D11
N$2  (via drill 0.35)
  Top 0.5: v20.25,37 21.5,37 FAN-ACT.A
  Bottom 0.5: v20.25,37 22,37 R5.1
N$3  (via drill 0.35)
  Top 0.5: v16.5,21.25 17.75,21.25 BTSTA.A
  Bottom 0.5: v16.5,21.25 18.25,21.25 R6.1
N$4  (via drill 0.35)
  Top 0.5: v18,19 18,17.5 BTACT.A
  Bottom 0.5: v18,19 18,17.5 18.25,17.5 R7.1
ODROID-3V3-IN  (via drill 0.35)
  Top 0.5: v65.75,72.25 v63.5,70
  Bottom 0.5: v63.5,70 63.5,65 62.5,64 57.75,64 57.75,59.5 PC-PWR.1 | v65.75,72.25 64.75,73.25 64.75,73.75 R1.2
ODROID-PWR-BTN
  Bottom 0.5: PC-SW.4 65.5,59.5 66.75,60.75 66.75,78.5 50.75,78.5 49,76.75 JP-N2.11
ODROID-PWR-BTN-CTRL  (via drill 0.35)
  Top 0.5: v63.25,49.5 64,48.75 64,47.75 NANO_33_IOT.D9
  Bottom 0.5: v63.25,49.5 65.5,51.75 65.5,53 PC-SW.1
ODROID-PWR-SENS  (via drill 0.35)
  Top 0.5: v57.5,48.75 58.5,47.75 NANO_33_IOT.D7
  Bottom 0.5: v57.5,48.75 57.75,48.75 57.75,53 PC-PWR.4
PS3V3-LED  (via drill 0.35)
  Top 0.5: v18,26.75 18,25.25 PS3V3.A
  Bottom 0.5: v18,26.75 18,25.25 18.25,25.25 R23.1
PS5V-LED  (via drill 0.35)
  Top 0.762: v27.25,26.75 27.25,25.25 PS5V.A
  Bottom 0.762: v27.25,26.75 26.75,26.25 26.75,25.25 R4.1
PS12V-LED  (via drill 0.35)
  Top 0.5: v17.25,13.75 18.5,13.75 PS12V.A
  Bottom 0.5: v17.25,13.75 17.5,13.5 18.5,13.5 R25.1
PWM1-D2
  Top 0.5: NANO_33_IOT.D2 46,47.5 44,45.5 33,45.5 27.5,51 23,51 20.5,48.5 FAN1.1
PWM2-D3  (via drill 0.35)
  Top 0.5: v39.5,54.5 43.5,54.5
  Top 0.508: 43.5,54.5 48.58,49.42 NANO_33_IOT.D3
  Bottom 0.5: v39.5,54.5 33.5,48.5 28,48.5 27.5,49 27,49 FAN2.1
SCK  (via drill 0.35)
  Top 0.508: IC2.13 v37.47,39.05 | v47.94,61.59 48.26,61.91 70.8,61.91 71.44,62.55 NANO_33_IOT.D13
  Bottom 0.508: v37.47,39.05 37.47,51.12 v47.94,61.59
SCL  (via drill 0.35)
  Top 0.5: v51,67.25 51,65.5 NANO_33_IOT.A5
  Top 0.508: v49.85,39.69 IC4.4 49.85,29.7 49.53,29.38 45.55,29.38 v42.23,32.7 | v51.12,63.5 NANO_33_IOT.A5 | OLED.1 6.84,30.16 v10.16,30.16 | v14.61,30.16 19.68,35.24 v39.69,35.24
  Bottom 0.5: v51,67.25 51,68.75 SCL-N.2
  Bottom 0.508: v49.85,39.69 49.85,62.23 50.71,63.09 v51.12,63.5 | v10.16,30.16 v14.61,30.16 | v39.69,35.24 v42.23,32.7
SCL-2  (via drill 0.35)
  Top 0.5: v53,70.25 59.25,70.25 60.25,69.25 60.75,69.25 64.5,73 64.5,78 63,79.5 59.5,79.5 56.75,76.75 JP-N2.5
  Bottom 0.5: v53,70.25 51,70.25 SCL-N.1
SDA  (via drill 0.35)
  Top 0.5: v54.25,67.25 53.5,66.5 53.5,65.5 NANO_33_IOT.A4
  Top 0.508: v51.12,39.69 IC4.3 51.12,29.21 50.48,28.58 45.09,28.58 v41.27,32.39 | v53.66,63.5 NANO_33_IOT.A4 | OLED.2 7.89,29.21 v10.16,29.21 | v14.61,29.21 14.79,29.21 19.98,34.39 v39.05,34.39
  Bottom 0.5: v54.25,67.25 54.25,68.75 SDA-N.2
  Bottom 0.508: v53.66,63.5 53.18,63.02 51.12,60.96 v51.12,39.69 | v10.16,29.21 v14.61,29.21 | v39.05,34.39 39.27,34.39 v41.27,32.39
SDA-2  (via drill 0.35)
  Top 0.5: v60.5,70.25 63.5,73.25 63.5,77.75 62.75,78.5 60.25,78.5 59,77.25 59,76.75 JP-N2.3
  Bottom 0.5: v60.5,70.25 54.5,70.25 SDA-N.1
SHUNT+
  Top 0.762: IC4.8 53.75,25.5 55,24.25 55,23 R18.2
THERM-VO-SENS  (via drill 0.35)
  Top 0.5: v62.5,65.25 63.75,65.25 NANO_33_IOT.A0
  Bottom 0.5: TEMP.2 5.5,45.75 6.5,45.75 6.75,46 8.5,46 R3.2 8.75,46 9.75,46 22,58.25 39.5,58.25 46.25,65 62.25,65 v62.5,65.25

### Text on the board
tPlace: L|P | L|H
tNames: A1 / A7 / D4 | BAT-AP | + - | PSU | PC | 12V | IGN | IGN-AP | BAT | + - | + - | + - | + + | + - | + -